# Altium schematic sheet EPS_Local-Supply.SchDoc: Local Supply
size A4
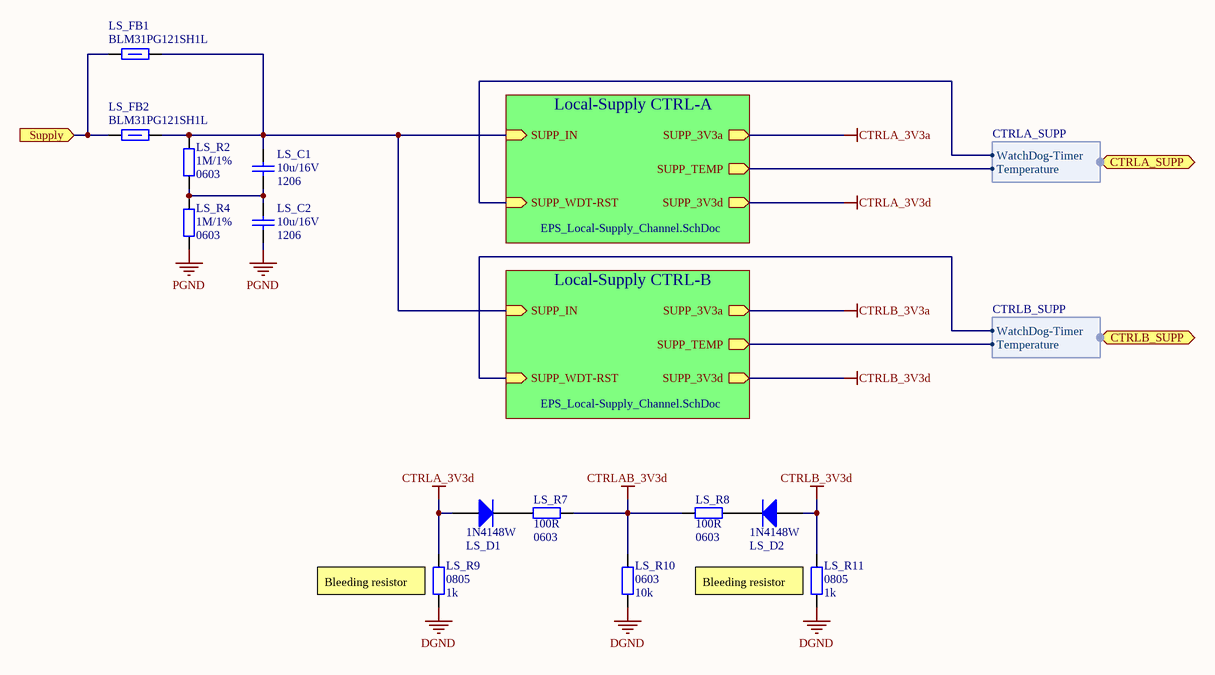
[diagram p0: EPS_Local-Supply.SchDoc]

## Parts
LS_C1  Packge: 1206  [SMD_Capacitor_1206]  (hidden comment: 10u/16V)
LS_C2  Packge: 1206  [SMD_Capacitor_1206]  (hidden comment: 10u/16V)
LS_D1  1N4148W  [SOD-123]
LS_D2  1N4148W  [SOD-123]
LS_FB1  120R/100MHz  [SMD_FerriteBead_1206]  (value not drawn)
LS_FB2  120R/100MHz  [SMD_FerriteBead_1206]  (value not drawn)
LS_R2  Package: 0603  [SMD_Resistor_0603]  (hidden comment: 1M/1%)
LS_R4  Package: 0603  [SMD_Resistor_0603]  (hidden comment: 1M/1%)
LS_R7  Package: 0603  [SMD_Resistor_0603]  (hidden comment: 100R)
LS_R8  Package: 0603  [SMD_Resistor_0603]  (hidden comment: 100R)
LS_R9  Package: 0805  [SMD_Resistor_0805]  (hidden comment: 1k)
LS_R10  Package: 0603  [SMD_Resistor_0603]  (hidden comment: 10k)
LS_R11  Package: 0805  [SMD_Resistor_0805]  (hidden comment: 1k)

## Sub-sheets
Local-Supply CTRL-A = EPS_Local-Supply_Channel.SchDoc: SUPP_IN (in), SUPP_3V3d (out), SUPP_3V3a (out), SUPP_WDT-RST (in), SUPP_TEMP (out)
Local-Supply CTRL-B = EPS_Local-Supply_Channel.SchDoc: SUPP_IN (in), SUPP_3V3d (out), SUPP_3V3a (out), SUPP_WDT-RST (in), SUPP_TEMP (out)

## Ports
CTRLA_SUPP (harness CTRLA_SUPP), CTRLB_SUPP (harness CTRLB_SUPP), Supply (in)

## Harnesses
CTRLA_SUPP: Temperature, WatchDog-Timer
CTRLB_SUPP: Temperature, WatchDog-Timer

## Nets
CTRLA_3V3a: sheet Local-Supply CTRL-A/SUPP_3V3a
CTRLA_3V3d: LS_D1.A LS_R9.2 ; sheet Local-Supply CTRL-A/SUPP_3V3d
CTRLAB_3V3d: LS_R7.2 LS_R8.1 LS_R10.2
CTRLB_3V3a: sheet Local-Supply CTRL-B/SUPP_3V3a
CTRLB_3V3d: LS_D2.A LS_R11.2 ; sheet Local-Supply CTRL-B/SUPP_3V3d
DGND: LS_R9.1 LS_R10.1 LS_R11.1
PGND: LS_C2.2 LS_R4.2
Supply: LS_FB1.1 LS_FB2.1 ; port Supply
NetLS_C1_1: LS_C1.1 LS_FB1.2 LS_FB2.2 LS_R2.1 ; sheet Local-Supply CTRL-A/SUPP_IN, sheet Local-Supply CTRL-B/SUPP_IN
NetLS_C1_2: LS_C1.2 LS_C2.1 LS_R2.2 LS_R4.1
NetLS_D1_K: LS_D1.K LS_R7.1
NetLS_D2_K: LS_D2.K LS_R8.2
(unnamed): sheet Local-Supply CTRL-A/SUPP_WDT-RST, port CTRLA_SUPP.WatchDog-Timer
(unnamed): sheet Local-Supply CTRL-A/SUPP_TEMP, port CTRLA_SUPP.Temperature
(unnamed): sheet Local-Supply CTRL-B/SUPP_WDT-RST, port CTRLB_SUPP.WatchDog-Timer
(unnamed): sheet Local-Supply CTRL-B/SUPP_TEMP, port CTRLB_SUPP.Temperature

## Notes on the sheet
- (near LS_R9) Bleeding resistor
- (near LS_R11) Bleeding resistor
- Title:
- Project:
- Author:
- Model:
- Document Number:
- Checked by:
- Rev:
- Date:
- Approved by:
- Sheet:
- of
- File name:

## Library data of the parts
LS_C1 LS_C2 = Cer_C1206T106K4RACTU: Ceramic Cap Kemet COTS 10u/16V X7R 1206; ManufacturerPartNumber: C1206T106K4RACTU; Manufacturer: Kemet; Value: 10u/16V
LS_D1 LS_D2 = 1N4148W: Small Signal Fast Switching Diode; Manufacturer: Vishay; Value: 1N4148W
LS_FB1 LS_FB2 = BLM31PG121SH1L: Ferrite bead, 1206, 0.02HM, 3.5A.; Manufacturer: Murata; Current Rating: 3.5A; Series Resistance DC: 0.02R; Package: 1206; Value: 120R/100MHz; ManufacturerPartNumber: BLM31PG121SH1L
LS_R2 LS_R4 LS_R7-LS_R11 = Res
  LS_R2 LS_R4: Value: 1M/1%
  LS_R7 LS_R8: Value: 100R
  LS_R9 LS_R11: Value: 1k
  LS_R10: Value: 10k